# EAGLE design Loguino_mini_v1.2 (EAGLE 6.6.0)
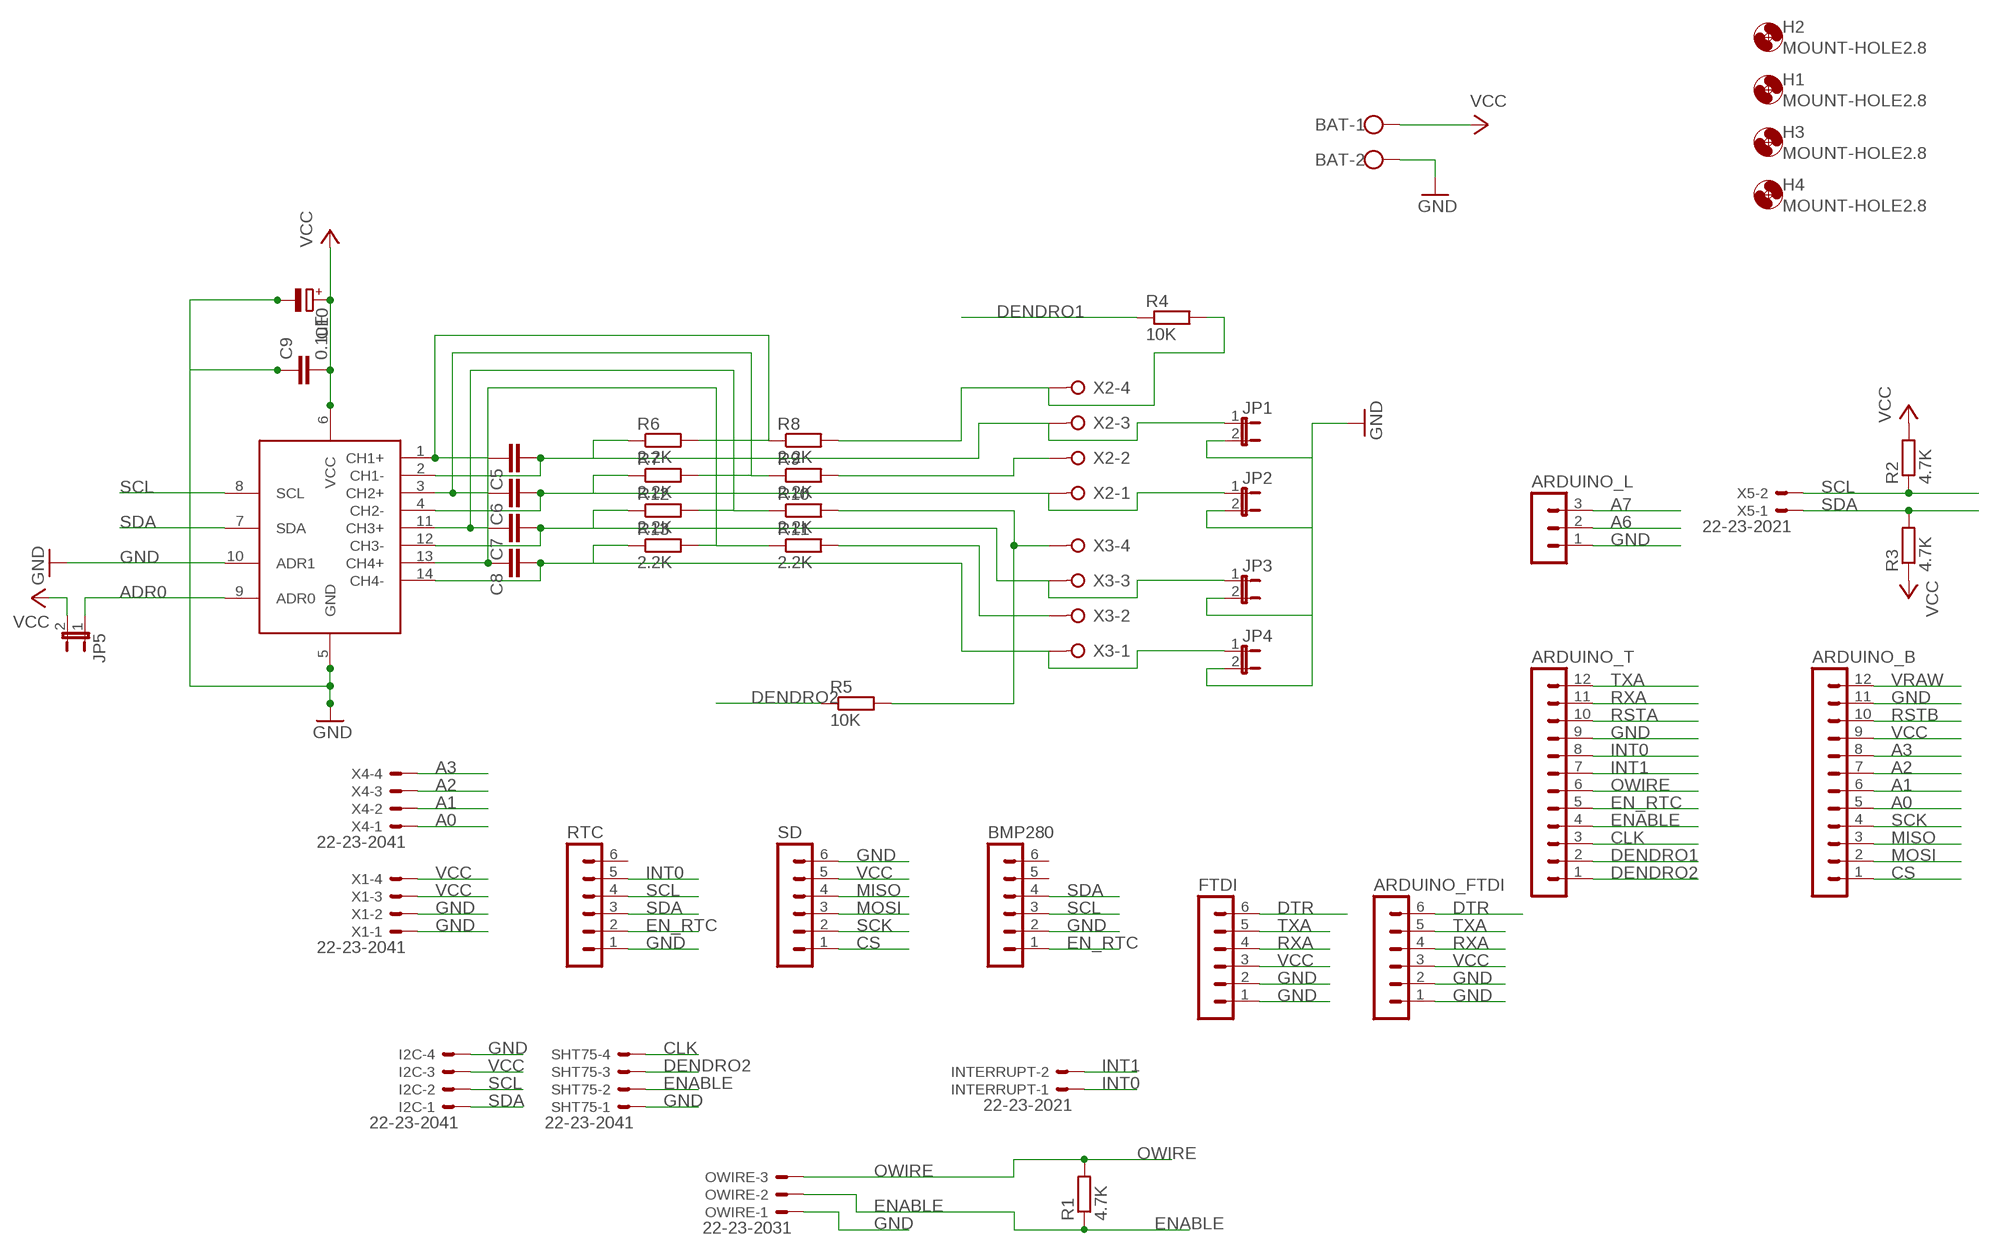
[diagram p0: schematic, sheet 1]

## Parts
ARDUINO_B  MA12-1  [MA12-1]
ARDUINO_FTDI  MA06-1  [MA06-1]
ARDUINO_L  MA03-1  [MA03-1]
ARDUINO_T  MA12-1  [MA12-1]
BAT  W237-102  [W237-102]
BMP280  MA06-1  [MA06-1]
C5  C-EU025-024X044  [C025-024X044]
C6  C-EU025-024X044  [C025-024X044]
C7  C-EU025-024X044  [C025-024X044]
C8  C-EU025-024X044  [C025-024X044]
C9  0.1uF  C-EU050-025X075  [C050-025X075]
C10  CPOL-EUE2,5-6E  [E2,5-6E]
FTDI  MA06-1  [MA06-1]
H1  MOUNT-HOLE2.8  [2,8]
H2  MOUNT-HOLE2.8  [2,8]
H3  MOUNT-HOLE2.8  [2,8]
H4  MOUNT-HOLE2.8  [2,8]
I2C  22-23-2041  [22-23-2041]
INTERRUPT  22-23-2021  [22-23-2021]
JP1  JP1E  [JP1]
JP2  JP1E  [JP1]
JP3  JP1E  [JP1]
JP4  JP1E  [JP1]
JP5  JP1E  [JP1]
OWIRE  22-23-2031  [22-23-2031]
R1  4.7K  R-EU_0204/7  [0204/7]
R2  4.7K  R-EU_0204/7  [0204/7]
R3  4.7K  R-EU_0204/7  [0204/7]
R4  10K  R-EU_0207/10  [0207/10]
R5  10K  R-EU_0207/10  [0207/10]
R6  2.2K  R-EU_0207/10  [0207/10]
R7  2.2K  R-EU_0207/10  [0207/10]
R8  2.2K  R-EU_0207/10  [0207/10]
R9  2.2K  R-EU_0207/10  [0207/10]
R10  2.2K  R-EU_0207/10  [0207/10]
R11  2.2K  R-EU_0207/10  [0207/10]
R12  2.2K  R-EU_0207/10  [0207/10]
R13  2.2K  R-EU_0207/10  [0207/10]
RTC  MA06-1  [MA06-1]
SD  MA06-1  [MA06-1]
SHT75  22-23-2041  [22-23-2041]
U$2  MCP342  [SO14]
X1  22-23-2041  [22-23-2041]
X2  W237-04P  [W237-4P]
X3  W237-04P  [W237-4P]
X4  22-23-2041  [22-23-2041]
X5  22-23-2021  [22-23-2021]

## Nets
A0: ARDUINO_B.5 X4.1
A1: ARDUINO_B.6 X4.2
A2: ARDUINO_B.7 X4.3
A3: ARDUINO_B.8 X4.4
A6: ARDUINO_L.2
A7: ARDUINO_L.3
ADR0: JP5.1 U$2.9(ADR0)
CLK: ARDUINO_T.3 SHT75.4
CS: ARDUINO_B.1 SD.1
DENDRO1: ARDUINO_T.2 R4.1
DENDRO2: ARDUINO_T.1 R5.1 SHT75.3
DTR: ARDUINO_FTDI.6 FTDI.6
EN_RTC: ARDUINO_T.5 BMP280.1 RTC.2
ENABLE: ARDUINO_T.4 OWIRE.2 R1.1 SHT75.2
GND: ARDUINO_B.11 ARDUINO_FTDI.1 ARDUINO_FTDI.2 ARDUINO_L.1 ARDUINO_T.9 BAT.2 BMP280.2 C9.1 C10.- FTDI.1 FTDI.2 I2C.4 JP1.2 JP2.2 JP3.2 JP4.2 OWIRE.1 RTC.1 SD.6 SHT75.1 U$2.5(GND) U$2.10(ADR1) X1.1 X1.2
INT0: ARDUINO_T.8 INTERRUPT.1 RTC.5
INT1: ARDUINO_T.7 INTERRUPT.2
MISO: ARDUINO_B.3 SD.4
MOSI: ARDUINO_B.2 SD.3
N$2: C5.2 JP1.1 R6.1 U$2.2(CH1-) X2.3
N$4: R4.2 R8.2 X2.4
N$8: R9.2 X2.2
N$9: R5.2 R10.2 X3.4
N$10: R11.2 X3.2
N$12: C5.1 R6.2 R8.1 U$2.1(CH1+)
N$14: C6.1 R7.2 R9.1 U$2.3(CH2+)
N$16: C7.1 R10.1 R12.2 U$2.11(CH3+)
N$17: C8.1 R11.1 R13.2 U$2.13(CH4+)
N$21: C6.2 JP2.1 R7.1 U$2.4(CH2-) X2.1
N$22: C7.2 JP3.1 R12.1 U$2.12(CH3-) X3.3
N$23: C8.2 JP4.1 R13.1 U$2.14(CH4-) X3.1
OWIRE: ARDUINO_T.6 OWIRE.3 R1.2
RSTA: ARDUINO_T.10
RSTB: ARDUINO_B.10
RXA: ARDUINO_FTDI.4 ARDUINO_T.11 FTDI.4
SCK: ARDUINO_B.4 SD.2
SCL: BMP280.3 I2C.2 R2.1 RTC.4 U$2.8(SCL) X5.2
SDA: BMP280.4 I2C.1 R3.2 RTC.3 U$2.7(SDA) X5.1
TXA: ARDUINO_FTDI.5 ARDUINO_T.12 FTDI.5
VCC: ARDUINO_B.9 ARDUINO_FTDI.3 BAT.1 C9.2 C10.+ FTDI.3 I2C.3 JP5.2 R2.2 R3.1 SD.5 U$2.6(VCC) X1.3 X1.4
VRAW: ARDUINO_B.12
Unconnected: BMP280.5 BMP280.6 RTC.6

## Library data of the parts
ARDUINO_B ARDUINO_T = con-lstb:MA12-1: PIN HEADER; OC_FARNELL: unknown; OC_NEWARK: unknown
ARDUINO_FTDI BMP280 FTDI RTC SD = con-lstb:MA06-1: PIN HEADER; OC_FARNELL: unknown; OC_NEWARK: unknown
ARDUINO_L = con-lstb:MA03-1: PIN HEADER; OC_FARNELL: unknown; OC_NEWARK: unknown
BAT = con-wago-500:W237-102: WAGO SCREW CLAMP; MPN: 237-102; OC_FARNELL: unknown; OC_NEWARK: 70K9898
C5-C9 = rcl:C-EU: CAPACITOR, European symbol
C10 = rcl:CPOL-EU: POLARIZED CAPACITOR, European symbol
H1-H4 = holes:MOUNT-HOLE: MOUNTING HOLE with drill center marker
I2C SHT75 X1 X4 = con-molex:22-23-2041: .100" (2.54mm) Center Header - 4 Pin; MF: MOLEX; MPN: 22-23-2041; OC_FARNELL: 1462920; OC_NEWARK: 38C0355
INTERRUPT X5 = con-molex:22-23-2021: .100" (2.54mm) Center Header - 2 Pin; MF: MOLEX; MPN: 22-23-2021; OC_FARNELL: 1462926; OC_NEWARK: 25C3832
JP1-JP5 = jumper:JP1E: JUMPER
OWIRE = con-molex:22-23-2031: .100" (2.54mm) Center Header - 3 Pin; MF: MOLEX; MPN: 22-23-2031; OC_FARNELL: 1462950; OC_NEWARK: 30C0862
R1-R3 = rcl:R-EU_: RESISTOR, European symbol
R4-R13 = resistor:R-EU_: RESISTOR, European symbol
U$2 = linear2:MCP342
X2 X3 = con-wago-508:W237-04P: WAGO SREW CLAMP; OC_FARNELL: unknown; OC_NEWARK: unknown

## Board
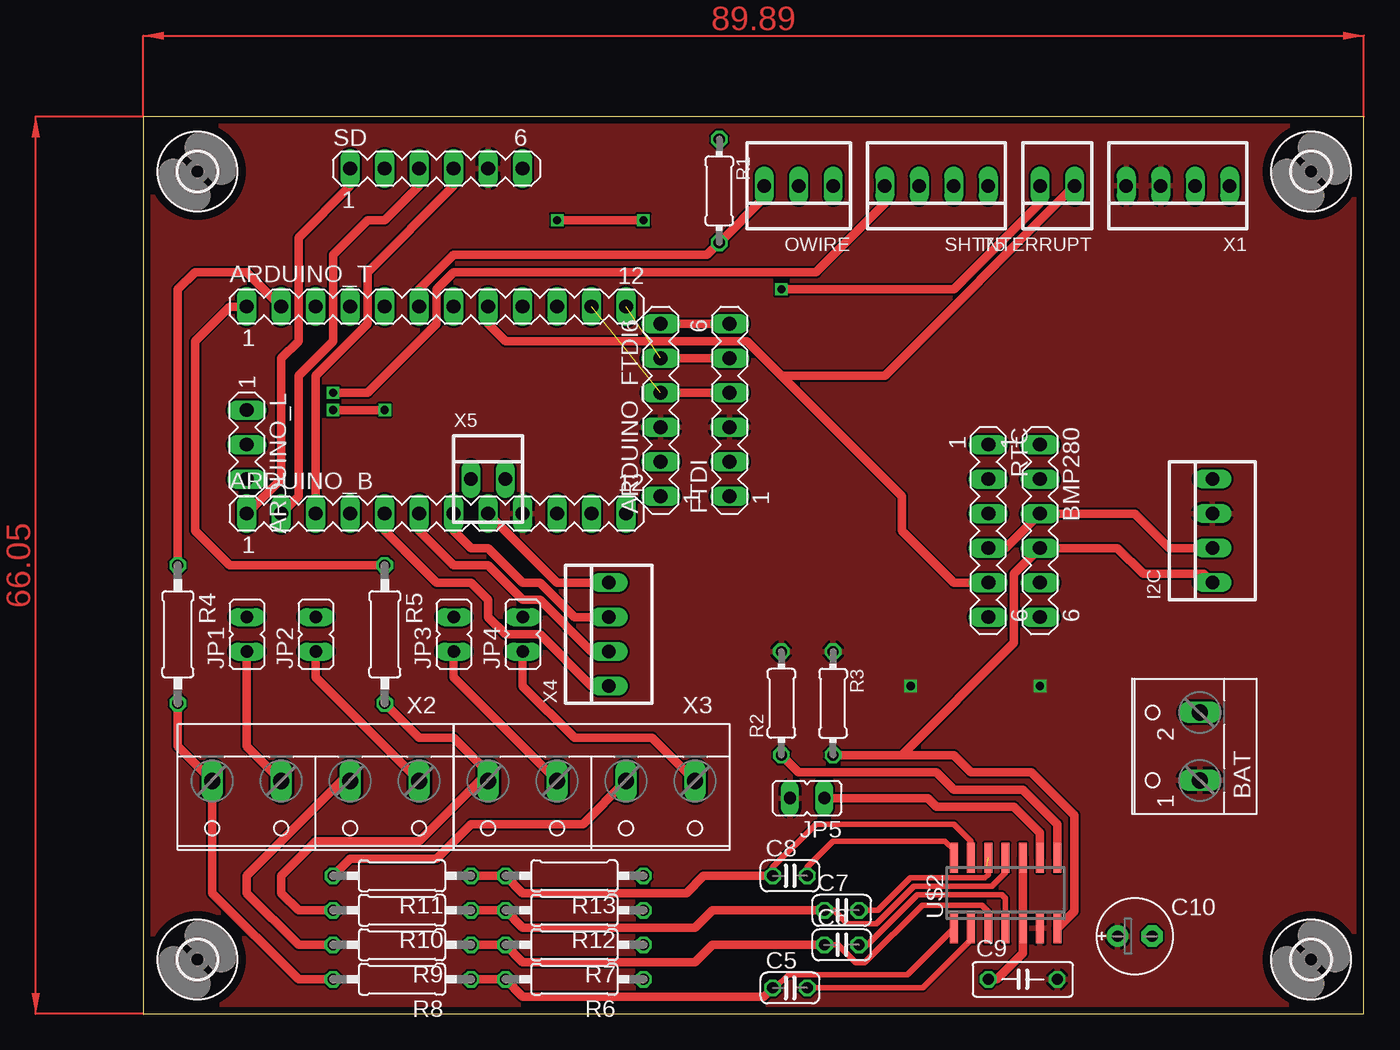
[diagram p1: board, top side]
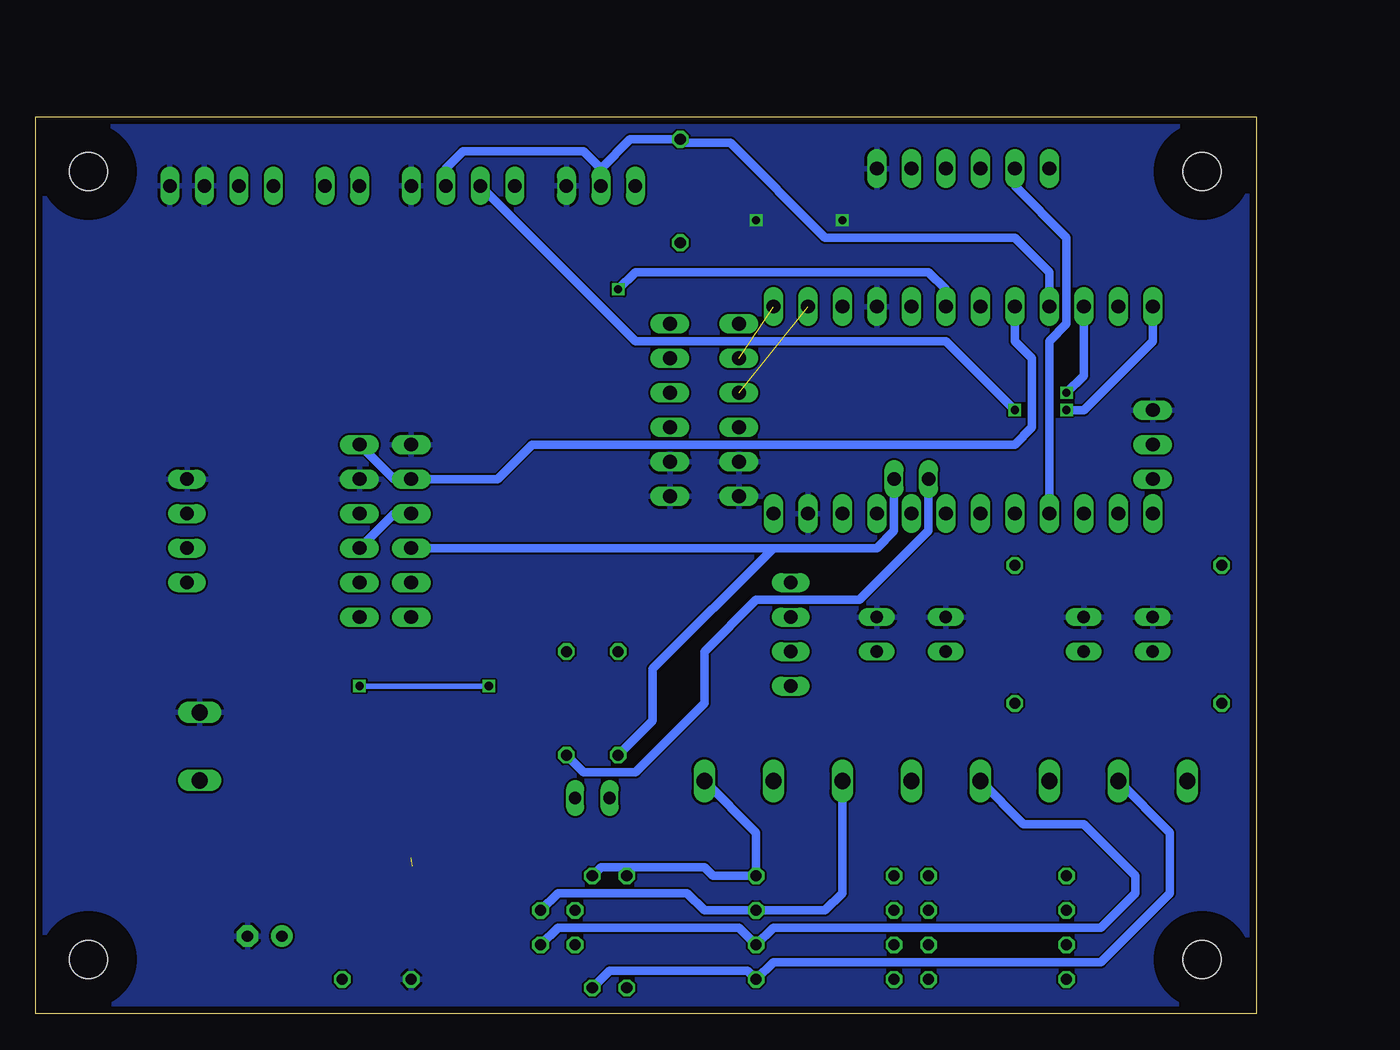
[diagram p2: board, bottom side, seen from below]

Size 89.89 x 66.05 mm. Coordinates in mm from the lower left corner, seen from the top.
Outline: 0,0 89.89,0 89.89,66.05 0,66.05 0,0
Copper layers (1*16): Top 0.035mm / dielectric 1.5mm / Bottom 0.035mm
Design rules "Aetzwerk-DRC 2 Lagen 35цm Cu": minimum track width 6mil, minimum drill 12mil, track to track 6mil, track to pad 6mil, pad to pad 6mil, via to via 6mil, smd to smd 6mil, copper to edge 20mil, drill to drill 8mil, minimum pad ring 8mil, minimum via ring 6mil, stop-mask expansion 3mil, vias tented up to drill 0mil, thermal gap 8mil

### Footprints (pad centres in the part's own frame; a part is rotated, then mirrored left to right if it is on the bottom)
MA12-1 = drill 1.016 long: 1 -13.97,0; 2 -11.43,0; 3 -8.89,0; 4 -6.35,0; 5 -3.81,0; 6 -1.27,0; 7 1.27,0; 8 3.81,0; 9 6.35,0; 10 8.89,0; 11 11.43,0; 12 13.97,0
MA06-1 = drill 1.016 long: 1 -6.35,0; 2 -3.81,0; 3 -1.27,0; 4 1.27,0; 5 3.81,0; 6 6.35,0
MA03-1 = drill 1.016 long: 1 -2.54,0; 2 0,0; 3 2.54,0
W237-102 = drill 1.194 long: 1 -2.5,-1.27; 2 2.5,-1.27
C025-024X044 = drill 0.813 octagon: 1 -1.27,0; 2 1.27,0
C050-025X075 = drill 0.813 octagon: 1 -2.54,0; 2 2.54,0
E2,5-6E = drill 0.813 pad 1.575: + -1.27,0 | drill 0.813 pad 1.575 octagon: - 1.27,0
2,8 = hole 2.8: 0,0
22-23-2041 = drill 1 long: 1 -3.81,0; 2 -1.27,0; 3 1.27,0; 4 3.81,0
22-23-2021 = drill 1 long: 1 -1.27,0; 2 1.27,0
JP1 = drill 0.914 long: 1 0,-1.27; 2 0,1.27
22-23-2031 = drill 1 long: 1 -2.54,0; 2 0,0; 3 2.54,0
0204/7 = drill 0.813 octagon: 1 -3.81,0; 2 3.81,0
0207/10 = drill 0.813 octagon: 1 -5.08,0; 2 5.08,0
SO14 = smd 0.6 x 2.2: 1 -3.81,-2.6; 2 -2.54,-2.6; 3 -1.27,-2.6; 4 0,-2.6; 5 1.27,-2.6; 6 2.54,-2.6; 7 3.81,-2.6; 8 3.81,2.6; 9 2.54,2.6; 10 1.27,2.6; 11 0,2.6; 12 -1.27,2.6; 13 -2.54,2.6; 14 -3.81,2.6
W237-4P = drill 1.194 long: 1 -7.62,-0.635; 2 -2.54,-0.635; 3 2.54,-0.635; 4 7.62,-0.635

### Placement (x,y rotation side)
ARDUINO_B  21.59,36.83 0 top
ARDUINO_FTDI  38.1,44.45 90 top
ARDUINO_L  7.62,41.91 270 top
ARDUINO_T  21.59,52.07 0 top
BAT  76.54,19.68 90 top
BMP280  66.04,35.56 270 top
C5  47.62,1.91 0 top
C6  51.44,5.08 0 top
C7  51.44,7.62 0 top
C8  47.62,10.16 0 top
C9  64.77,2.54 0 top
C10  73.03,5.71 0 top
FTDI  43.18,44.45 90 top
H1  4,62 0 top
H2  86,62 0 top
H3  86,4 0 top
H4  4,4 0 top
I2C  78.74,35.56 90 top
INTERRUPT  67.31,60.96 180 top
JP1  7.62,27.94 0 top
JP2  12.7,27.94 0 top
JP3  22.86,27.94 0 top
JP4  27.94,27.94 0 top
JP5  48.9,15.88 90 top
OWIRE  48.26,60.96 180 top
R1  42.42,60.58 270 top
R2  46.99,22.86 90 top
R3  50.8,22.86 270 top
R4  2.54,27.94 270 top
R5  17.78,27.94 270 top
R6  31.75,2.54 180 top
R7  31.75,5.08 180 top
R8  19.05,2.54 180 top
R9  19.05,5.08 180 top
R10  19.05,7.62 180 top
R11  19.05,10.16 180 top
R12  31.75,7.62 180 top
R13  31.75,10.16 180 top
RTC  62.23,35.56 270 top
SD  21.59,62.23 0 top
SHT75  58.42,60.96 180 top
U$2  63.5,8.89 0 top
X1  76.2,60.96 180 top
X2  12.7,16.51 180 top
X3  33.02,16.51 180 top
X4  34.29,27.94 90 top
X5  25.4,39.37 0 top

### Tracks (layer width: path | path; a pad name or v marks a point on that pad's centre or on a via)
A0
  Top 0.61: ARDUINO_B.5 17.78,35.56 21.59,31.75 24.13,31.75 25.4,30.48 25.4,29.21 26.67,27.94 29.21,27.94 33.02,24.13 X4.1
A1
  Top 0.61: ARDUINO_B.6 20.32,35.56 22.86,33.02 25.4,33.02 27.94,30.48 29.21,30.48 33.02,26.67 X4.2
A2
  Top 0.61: ARDUINO_B.7 22.86,35.56 24.13,34.29 25.4,34.29 27.94,31.75 29.21,31.75 31.75,29.21 X4.3
A3
  Top 0.61: ARDUINO_B.8 30.48,31.75 X4.4
ADR0
  Top 0.61: U$2.9 66.04,13.34 64.14,15.24 58.42,15.24 57.78,15.88 JP5.1
CLK  (via drill 0.6)
  Top 0.61: v13.97,45.72 16.51,45.72 21.59,50.8 21.59,53.34 22.86,54.61 49.53,54.61 54.61,59.69 SHT75.4
  Bottom 0.61: ARDUINO_T.3 12.7,46.99 v13.97,45.72
CS
  Top 0.61: ARDUINO_B.1 10.16,39.37 10.16,48.26 11.43,49.53 11.43,57.15 15.24,60.96 SD.1
DENDRO1
  Top 0.61: ARDUINO_T.2 7.62,54.61 3.81,54.61 2.54,53.34 R4.1
DENDRO2  (via drill 0.6)
  Top 0.61: ARDUINO_T.1 6.35,52.07 3.81,49.53 3.81,35.56 6.35,33.02 R5.1 | v17.78,44.45 v13.97,44.45
  Bottom 0.61: SHT75.3 45.72,49.53 22.86,49.53 v17.78,44.45 | v13.97,44.45 12.7,44.45 7.62,49.53 ARDUINO_T.1
DTR
  Top 0.61: ARDUINO_FTDI.6 FTDI.6
EN_RTC
  Bottom 0.61: ARDUINO_T.5 17.78,49.53 16.51,48.26 16.51,43.18 17.78,41.91 53.34,41.91 55.88,39.37 RTC.2 63.5,39.37 BMP280.1
ENABLE
  Bottom 0.61: ARDUINO_T.4 15.24,54.61 17.78,57.15 31.75,57.15 38.73,64.14 42.16,64.14 R1.1 46.1,64.39 48.26,62.23 | OWIRE.2 48.26,62.23 | 48.26,62.23 49.53,63.5 58.42,63.5 59.69,62.23 SHT75.2
GND  (via drill 0.6)
  Top 0.61: v36.83,58.42 v30.48,58.42 | C9.1 62.87,2.54 64.77,4.45 U$2.5 U$2.10
  pour Bottom: -1.6,-1.35 90.75,-1.05 90.75,1.95 90.96,67.61 -1.14,67.76
INT0
  Top 0.61: ARDUINO_T.8 25.4,50.8 26.67,49.53 44.45,49.53 46.35,47.62 46.99,46.99 | 46.99,46.99 55.88,38.1 55.88,35.56 59.69,31.75 RTC.5 | INTERRUPT.1 54.61,46.99 46.99,46.99
INT1  (via drill 0.6)
  Top 0.61: v46.99,53.34 59.69,53.34 66.04,59.69 INTERRUPT.2
  Bottom 0.61: ARDUINO_T.7 22.86,53.34 24.13,54.61 45.72,54.61 v46.99,53.34
MISO
  Top 0.61: ARDUINO_B.3 12.7,46.99 16.51,50.8 16.51,54.61 22.86,60.96 SD.4
MOSI
  Top 0.61: ARDUINO_B.2 11.43,38.1 11.43,46.99 13.97,49.53 13.97,55.88 16.51,58.42 17.78,58.42 20.32,60.96 SD.3
N$2
  Top 0.406: C5.2 57.41,1.91 61,5.5 61,6.25 U$2.2
  Top 0.61: JP1.1 7.62,19.68 X2.3
  Bottom 0.61: X2.3 6.35,13.34 6.35,8.89 11.43,3.81 35.56,3.81 R6.1 37.47,3.17 47.62,3.17 C5.2
N$4
  Top 0.61: R4.2 2.54,19.68 X2.4 5.08,8.89 11.43,2.54 R8.2
N$8
  Top 0.61: X2.2 14.61,17.14 7.62,10.16 7.62,8.89 11.43,5.08 R9.2
N$9
  Top 0.61: R5.2 20.32,20.32 22.86,20.32 25.4,17.78 X3.4 24.77,17.14 20.32,12.7 12.7,12.7 10.16,10.16 10.16,8.89 11.43,7.62 R10.2
N$10
  Top 0.61: X3.2 32.38,13.97 24.13,13.97 21.59,11.43 15.24,11.43 R11.2
N$12
  Top 0.406: C5.1 46.53,1.91 47.5,2.88 56.27,2.88 U$2.1
  Top 0.61: R8.1 R6.2 27.94,1.27 45.72,1.27 C5.1
N$14
  Top 0.406: C6.1 51.17,5.08 52.5,3.75 53.12,3.75 57.38,8 61.75,8 62.25,7.5 62.25,6.31 U$2.3
  Top 0.61: R9.1 R7.2 27.94,3.81 40.64,3.81 41.91,5.08 C6.1
N$16
  Top 0.406: C7.1 50.88,7.62 51.88,6.62 54,6.62 56.75,9.38 62.5,9.38 63.5,10.38 U$2.11
  Top 0.61: R10.1 R12.2 27.94,6.35 40.64,6.35 41.91,7.62 C7.1
N$17
  Top 0.406: C8.1 46.35,10.79 49.53,13.97 59.69,13.97 60.96,12.7 U$2.13
  Top 0.61: R11.1 R13.2 27.94,8.89 40.01,8.89 41.27,10.16 C8.1
N$21
  Top 0.406: C6.2 53.33,5.08 57,8.75 63.25,8.75 63.5,8.5 U$2.4
  Top 0.61: JP2.1 12.7,24.77 X2.1
  Bottom 0.61: X2.1 17.14,13.97 12.7,13.97 8.89,10.16 8.89,8.89 11.43,6.35 35.56,6.35 R7.1 38.1,6.35 51.44,6.35 C6.2
N$22  (1 unrouted)
  Top 0.406: C7.2 54.12,7.62 56.5,10 62,10 62.25,10.25 62.25,10.75 62.12,10.88
  Top 0.61: JP3.1 22.86,24.77 X3.3
  Bottom 0.61: X3.3 30.48,8.89 31.75,7.62 R12.1 40.64,7.62 41.91,8.89 51.44,8.89 C7.2
N$23
  Top 0.406: C8.2 48.9,10.79 50.8,12.7 59.05,12.7 59.69,12.06 U$2.14
  Top 0.61: JP4.1 27.94,24.13 31.75,20.32 37.47,20.32 X3.1
  Bottom 0.61: X3.1 36.83,13.34 R13.1 40.01,10.16 40.64,10.79 48.26,10.79 C8.2
OWIRE
  Top 0.61: OWIRE.3 45.72,60.07 R1.2 41.53,55.88 22.86,55.88 20.32,53.34 ARDUINO_T.6
RXA  (1 unrouted)
  Top 0.61: ARDUINO_FTDI.4 FTDI.4
SCK
  Bottom 0.61: ARDUINO_B.4 15.24,49.53 13.97,50.8 13.97,57.15 17.78,60.96 SD.2
SCL
  Top 0.61: R2.1 48.26,17.78 58.42,17.78 59.69,16.51 64.77,16.51 67.31,13.97 U$2.8 | RTC.4 63.5,34.29 BMP280.3 73.03,36.83 75.56,34.29 I2C.2
  Bottom 0.61: X5.2 26.67,35.56 27.94,34.29 35.56,34.29 | 35.56,34.29 44.45,25.4 44.45,21.59 R2.1 | RTC.4 35.56,34.29
SDA
  Top 0.61: 55.88,19.05 R3.2 | 55.88,19.05 64.14,27.3 64.14,32.38 BMP280.4 71.75,34.29 73.66,32.38 78.11,32.38 I2C.1 | 55.88,19.05 59.69,19.05 60.96,17.78 65.41,17.78 68.58,14.61 68.58,7.56 U$2.7
  Bottom 0.61: X5.1 24.13,35.56 29.21,30.48 36.83,30.48 40.64,26.67 40.64,22.86 45.72,17.78 49.53,17.78 R3.2 | RTC.3 63.5,36.83 BMP280.4
TXA  (1 unrouted)
  Top 0.61: FTDI.5 ARDUINO_FTDI.5
VCC  (via drill 0.6)
  Bottom 0.406: v66.04,24.13 v56.52,24.13
  pour Top: -1.45,67.92 -1.6,-1.35 91.21,-1.5 91.36,67.76
(copper drawn outside any net)
  shapes: Top area x2